# EAGLE schematic IN-2Module (EAGLE 7.7.0)
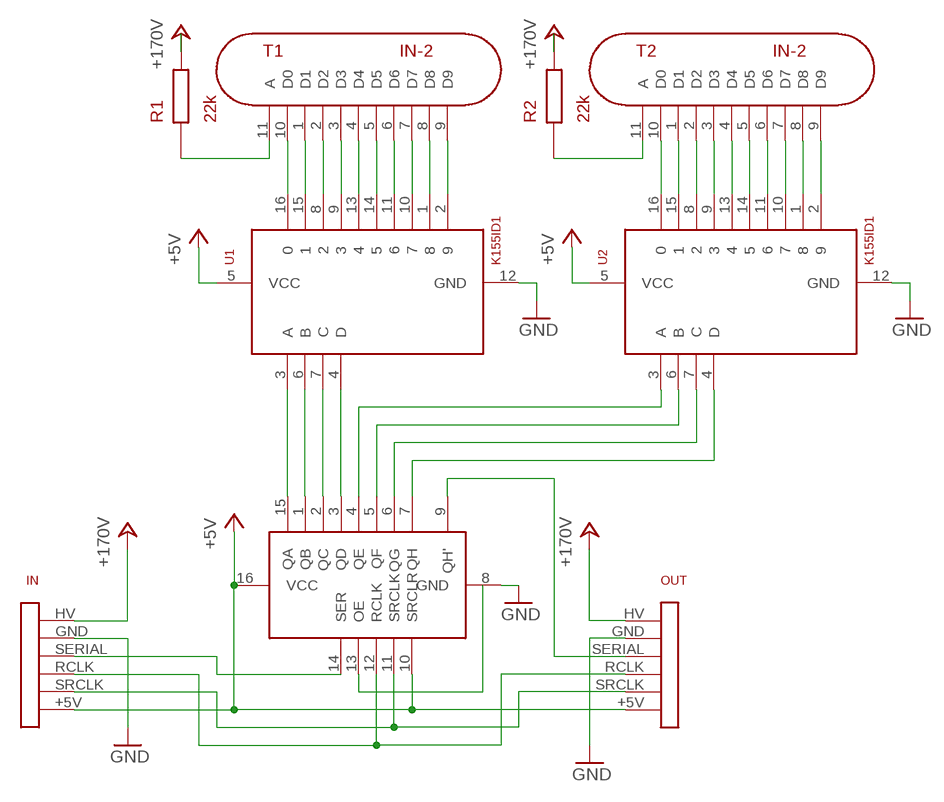
[diagram p0: schematic, sheet 1]

## Parts
IN  NIXIE_INTERCONNECT  [NIXIE_INTERCONNECT]
OUT  NIXIE_INTERCONNECT  [NIXIE_INTERCONNECT]
R1  22k  ANODE_RESISTOR  [ANODE_RESISTOR]
R2  22k  ANODE_RESISTOR  [ANODE_RESISTOR]
T1  IN-2  [IN-2]
T2  IN-2  [IN-2]
U1  K155ID1  [DIP16-2.54-19.2X7.62MM]
U2  K155ID1  [DIP16-2.54-19.2X7.62MM]
U3  74HC595  [DIL16]

## Nets
+5V: IN.+5V OUT.+5V U1.5(VCC) U2.5(VCC) U3.10(SRCLR) U3.16(VCC)
+24V: IN.HV OUT.HV R1.P$2 R2.P$2 ; supply symbol labelled +170V
GND: IN.GND OUT.GND U1.12(GND) U2.12(GND) U3.8(GND)
N$1: R1.P$1 T1.11(A)
N$2: T1.10(D0) U1.16
N$3: T1.1(D1) U1.15
N$4: T1.2(D2) U1.8
N$5: T1.3(D3) U1.9
N$6: T1.4(D4) U1.13
N$7: T1.5(D5) U1.14
N$8: T1.6(D6) U1.11
N$9: T1.7(D7) U1.10
N$10: T1.8(D8) U1.1
N$11: T1.9(D9) U1.2
N$12: R2.P$1 T2.11(A)
N$13: T2.10(D0) U2.16
N$14: T2.1(D1) U2.15
N$15: T2.2(D2) U2.8
N$16: T2.3(D3) U2.9
N$17: T2.4(D4) U2.13
N$18: T2.5(D5) U2.14
N$19: T2.6(D6) U2.11
N$20: T2.7(D7) U2.10
N$21: T2.8(D8) U2.1
N$22: T2.9(D9) U2.2
N$25: OUT.SERIAL U3.9(QH')
N$26: IN.SERIAL U3.14(SER)
N$27: IN.RCLK OUT.RCLK U3.12(RCLK)
N$29: IN.SRCLK OUT.SRCLK U3.11(SRCLK)
N$45: U3.13(OE)
N$67: U1.3(A) U3.15(QA)
N$68: U1.6(B) U3.1(QB)
N$69: U1.7(C) U3.2(QC)
N$70: U1.4(D) U3.3(QD)
N$71: U2.3(A) U3.4(QE)
N$72: U2.6(B) U3.5(QF)
N$73: U2.7(C) U3.6(QG)
N$74: U2.4(D) U3.7(QH)

## Library data of the parts
IN OUT = TimeExpander:NIXIE_INTERCONNECT
R1 R2 = TimeExpander:ANODE_RESISTOR: Anode resistor (Value is depending on drive voltage)
T1 T2 = TimeExpander:IN-2: Soviet IN-2 Nixie tube.
U1 U2 = TimeExpander:K155ID1: Soviet version of SN74141 BCD to Decimal Decoder / Nixie Driver
U3 = TimeExpander:74HC595: 8-Bit Shift Register